# Altium project linda-express.PrjPCB
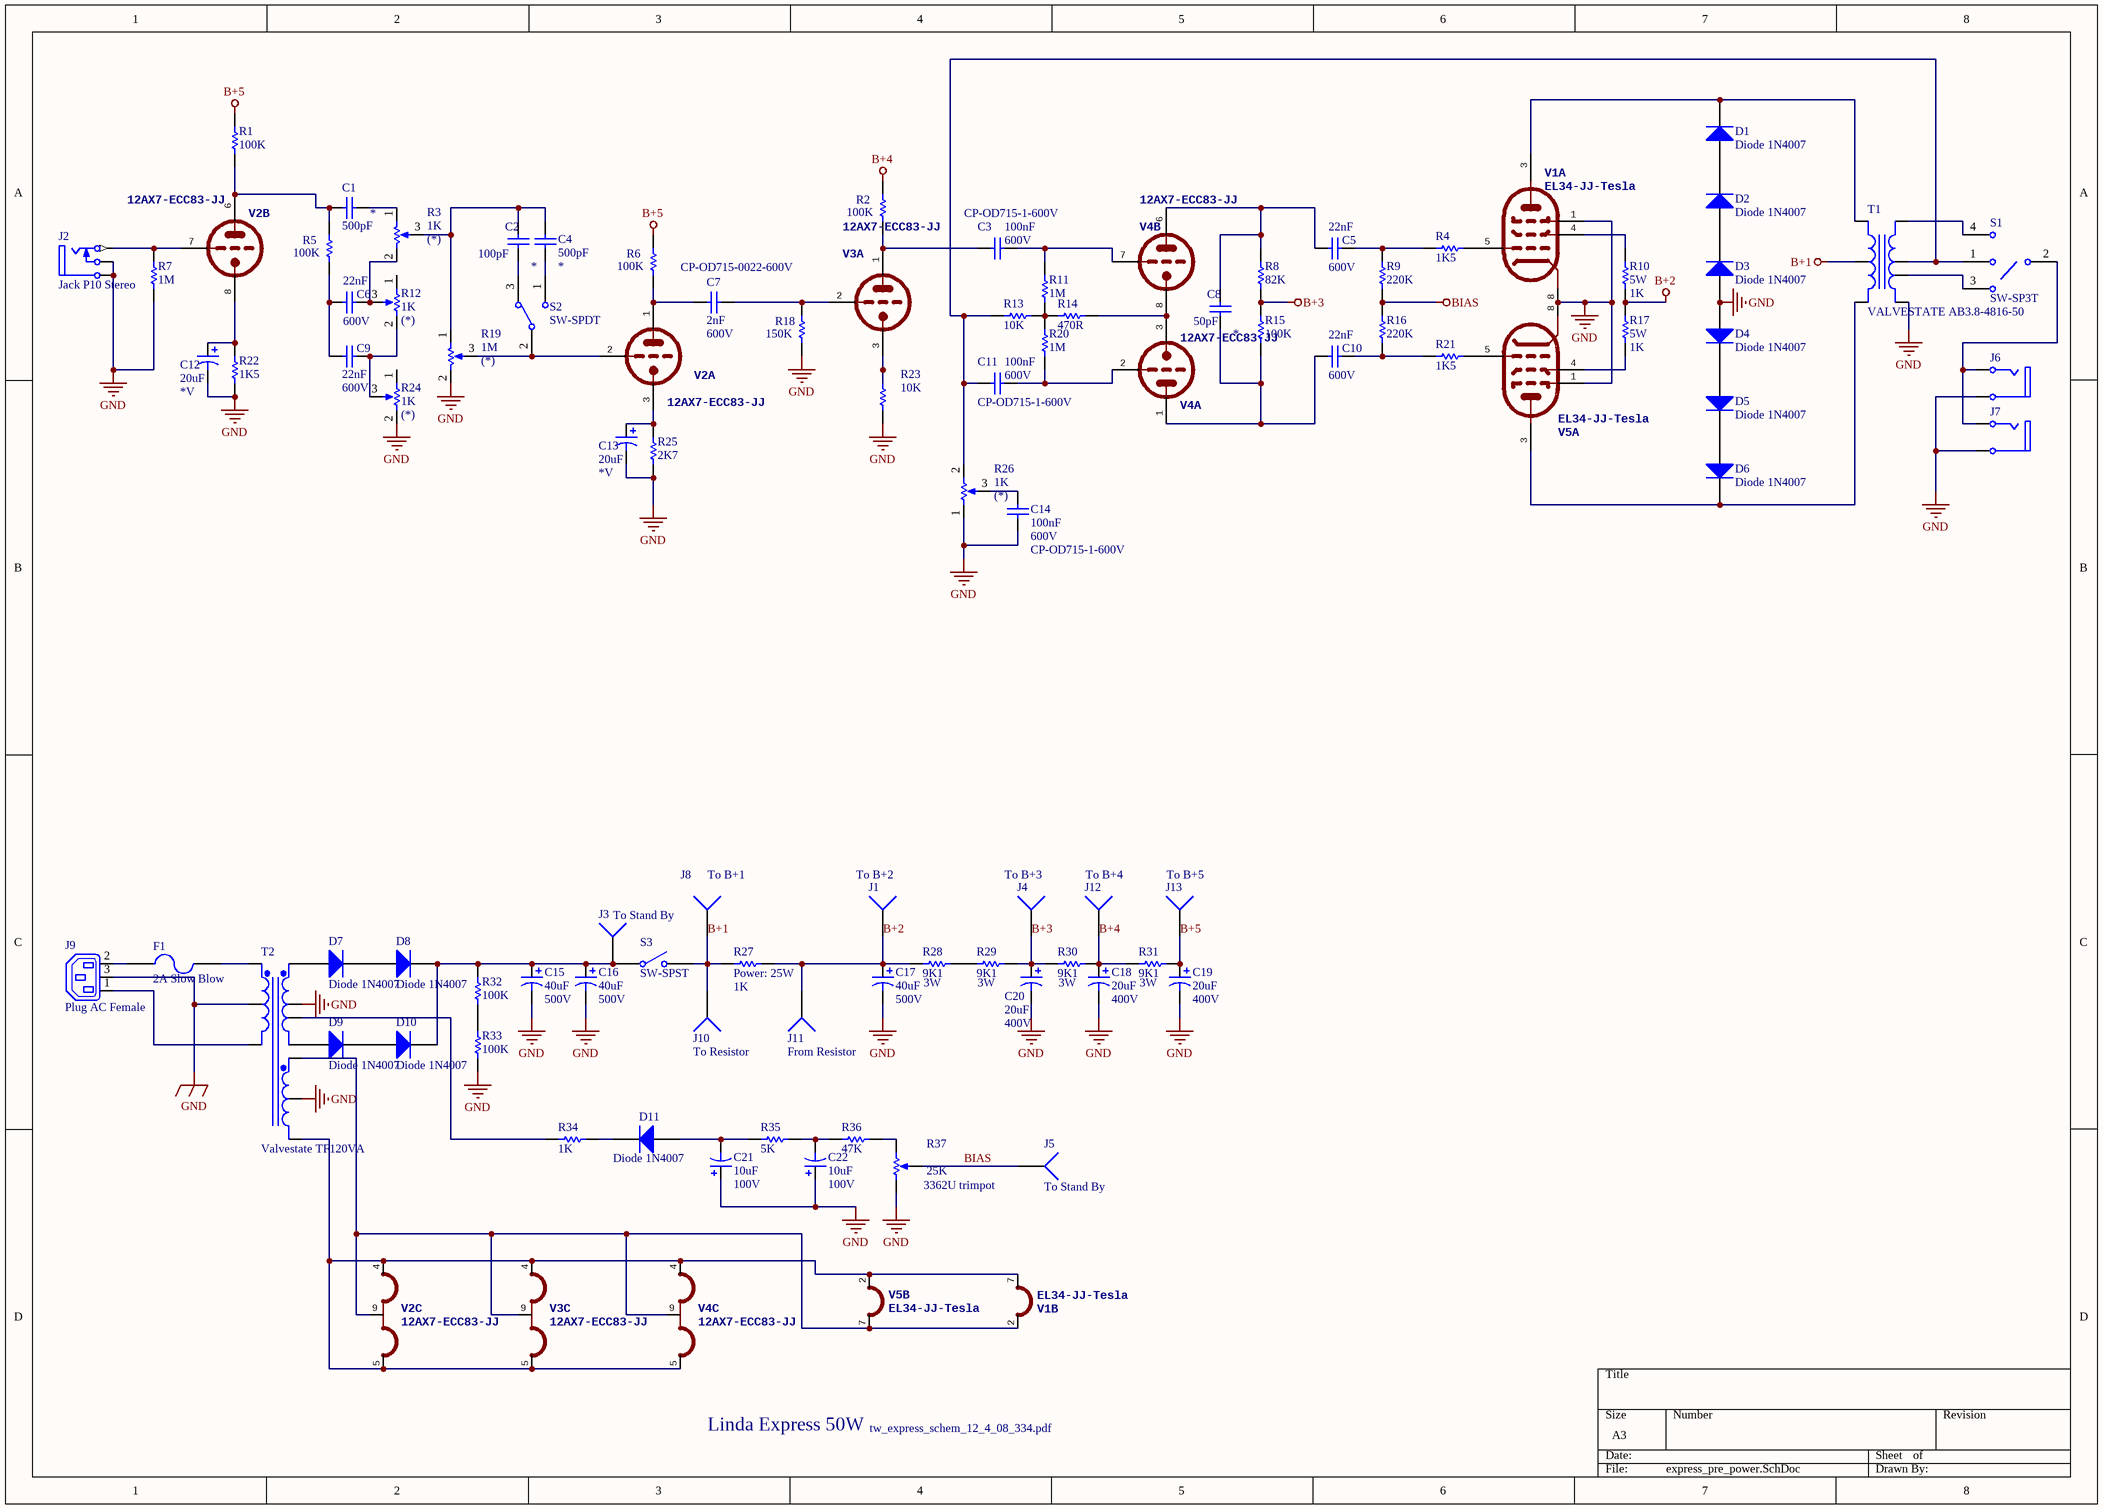
[diagram p0: express_pre_power.SchDoc]
1 sheet, 94 parts. Net scope: global (net labels, ports and power ports of the same name join across sheets).
Board file: linda-express-pcb-v0.1.PcbDoc

## Sheet express_pre_power.SchDoc: Linda Express 50W
size A3; Date: 25/05/2014; Author: Eduardo Marques; CompanyName: Linda HB Amplifiers; DrawnBy: Eduardo Marques; Engineer: Eduardo Marques; Organization: Linda HB Amplifiers; DocumentNumber: 1; Revision: 1; SheetNumber: 1; Based: tw_express_schem_12_4_08_334.pdf; CurrentTime: 08:04; CurrentDate: 25/05/2014; DocumentName: Linda TW Express 50W Complete; ProjectName: linda-express

### Parts
C1  value 500pF  [RAD-0.2]  (hidden comment: Ceramic Cap)
C2  value 100pF  [RAD-0.2]  (hidden comment: Ceramic Cap)
C3  value 100nF  Voltage: 600V  TUBEDEPOT_SN: CP-OD715-1-600V  [ORANGE-DROP-100nF-600V]  (hidden comment: Orange Drop Capacitor)
C4  value 500pF  [RAD-0.2]  (hidden comment: Ceramic Cap)
C5  value 22nF  Voltage: 600V  [ORANGE-DROP-22nF-600V]  (hidden comment: Orange Drop Capacitor)
C6  value 22nF  Voltage: 600V  [ORANGE-DROP-22nF-600V]  (hidden comment: Orange Drop Capacitor)
C7  value 2nF  Voltage: 600V  TubeDepotPN: CP-OD715-0022-600V  [ORANGE-DROP-2nF-600V]  (hidden comment: Orange Drop Capacitor)
C8  value 50pF  [RAD-0.2]  (hidden comment: Ceramic Cap)
C9  value 22nF  Voltage: 600V  [ORANGE-DROP-22nF-600V]  (hidden comment: Orange Drop Capacitor)
C10  value 22nF  Voltage: 600V  [ORANGE-DROP-22nF-600V]  (hidden comment: Orange Drop Capacitor)
C11  value 100nF  Voltage: 600V  TUBEDEPOT_SN: CP-OD715-1-600V  [ORANGE-DROP-100nF-600V]  (hidden comment: Orange Drop Capacitor)
C12  value 20uF  Voltage: *V  [AXIAL-POL-30mm]  (hidden comment: Cap Pol Axial)
C13  value 20uF  Voltage: *V  [AXIAL-POL-30mm]  (hidden comment: Cap Pol Axial)
C14  value 100nF  Voltage: 600V  TUBEDEPOT_SN: CP-OD715-1-600V  [ORANGE-DROP-100nF-600V]  (hidden comment: Orange Drop Capacitor)
C15  value 40uF  Voltage: 500V  [SPRAGUE-ATOM-40uF-500V]  (hidden comment: Sprague Atom Eletrolitic 40uF Axial 500V)
C16  value 40uF  Voltage: 500V  [SPRAGUE-ATOM-40uF-500V]  (hidden comment: Sprague Atom Eletrolitic 40uF Axial 500V)
C17  value 40uF  Voltage: 500V  [SPRAGUE-ATOM-40uF-500V]  (hidden comment: Sprague Atom Eletrolitic 40uF Axial 500V)
C18  value 20uF  Voltage: 400V  [RAD-POL-7.6-15]  (hidden comment: Cap Pol Rad)
C19  value 20uF  Voltage: 400V  [RAD-POL-7.6-15]  (hidden comment: Cap Pol Rad)
C20  value 20uF  Voltage: 400V  [RAD-POL-7.6-15]  (hidden comment: Cap Pol Rad)
C21  value 10uF  Voltage: 100V  [RAD-POL-16x20x7.5]  (hidden comment: Cap Pol Radial Vishay 22uF 100V)
C22  value 10uF  Voltage: 100V  [RAD-POL-16x20x7.5]  (hidden comment: Cap Pol Radial Vishay 22uF 100V)
D1  Diode 1N4007  [1N4007-10.46mm Diode]
D2  Diode 1N4007  [1N4007-10.46mm Diode]
D3  Diode 1N4007  [1N4007-10.46mm Diode]
D4  Diode 1N4007  [1N4007-10.46mm Diode]
D5  Diode 1N4007  [1N4007-10.46mm Diode]
D6  Diode 1N4007  [1N4007-10.46mm Diode]
D7  Diode 1N4007  [1N4007-10.46mm Diode]
D8  Diode 1N4007  [1N4007-10.46mm Diode]
D9  Diode 1N4007  [1N4007-10.46mm Diode]
D10  Diode 1N4007  [1N4007-10.46mm Diode]
D11  Diode 1N4007  [1N4007-10.46mm Diode]
F1  2A Slow Blow  [FUSE-PCB-5x20mm]  (mechanical)
J1  To B+2  [PIN1]  (mechanical)
J2  Jack P10 Stereo  [JACK-STEREO-3PAD]
J3  To Stand By  [PIN1]
J4  To B+3  [PIN1]  (mechanical)
J5  To Stand By  [PIN1]  (mechanical)
J6  Jack Mono  [JACK-STEREO-3PAD]  (value not drawn)  (mechanical)
J7  Jack Mono  [JACK-STEREO-3PAD]  (value not drawn)  (mechanical)
J8  To B+1  [PIN1]  (mechanical)
J9  Plug AC Female  [IEC7-2H3]  (mechanical)
J10  To Resistor  [PIN1]
J11  From Resistor  [PIN1]
J12  To B+4  [PIN1]  (mechanical)
J13  To B+5  [PIN1]  (mechanical)
R1  value 100K  [AXIAL-0.6]  (hidden comment: Metal Film Resistor 1/2W)
R2  value 100K  [AXIAL-0.6]  (hidden comment: Metal Film Resistor 1/2W)
R3  value 1K  TYPE: (*)  [pot_alpha]  (hidden comment: ALPHA Potentiometer)
R4  value 1K5  [AXIAL-0.6]  (hidden comment: Metal Film Resistor 1/2W)
R5  value 100K  [AXIAL-0.6]  (hidden comment: Metal Film Resistor 1/2W)
R6  value 100K  [AXIAL-0.6]  (hidden comment: Metal Film Resistor 1/2W)
R7  value 1M  [AXIAL-0.6]  (hidden comment: Metal Film Resistor 1/2W)  (mechanical)
R8  value 82K  [AXIAL-0.6]  (hidden comment: Metal Film Resistor 1/2W)
R9  value 220K  [AXIAL-0.6]  (hidden comment: Metal Film Resistor 1/2W)
R10  value 1K  Power: 5W  [Resistor Vishay 5W 1k Power Wirewound]  (hidden comment: Wire Wound Power Resistor)
R11  value 1M  [AXIAL-0.6]  (hidden comment: Metal Film Resistor 1/2W)
R12  value 1K  TYPE: (*)  [pot_alpha]  (hidden comment: ALPHA Potentiometer)
R13  value 10K  [AXIAL-0.6]  (hidden comment: Metal Film Resistor 1/2W)
R14  value 470R  [AXIAL-0.6]  (hidden comment: Metal Film Resistor 1/2W)
R15  value 100K  [AXIAL-0.6]  (hidden comment: Metal Film Resistor 1/2W)
R16  value 220K  [AXIAL-0.6]  (hidden comment: Metal Film Resistor 1/2W)
R17  value 1K  Power: 5W  [Resistor Vishay 5W 1k Power Wirewound]  (hidden comment: Wire Wound Power Resistor)
R18  value 150K  [AXIAL-0.6]  (hidden comment: Metal Film Resistor 1/2W)
R19  value 1M  TYPE: (*)  [pot_alpha]  (hidden comment: ALPHA Potentiometer)
R20  value 1M  [AXIAL-0.6]  (hidden comment: Metal Film Resistor 1/2W)
R21  value 1K5  [AXIAL-0.6]  (hidden comment: Metal Film Resistor 1/2W)
R22  value 1K5  [AXIAL-0.6]  (hidden comment: Metal Film Resistor 1/2W)
R23  value 10K  [AXIAL-0.6]  (hidden comment: Metal Film Resistor 1/2W)
R24  value 1K  TYPE: (*)  [pot_alpha]  (hidden comment: ALPHA Potentiometer)
R25  value 2K7  [AXIAL-0.6]  (hidden comment: Metal Film Resistor 1/2W)
R26  value 1K  TYPE: (*)  [pot_alpha]  (hidden comment: ALPHA Potentiometer)
R27  value 1K  Power: 25W  [Power Wirewound Resistor 10W - Vishay Dale]  (hidden comment: Wire Wound Power Resistor)  (mechanical)
R28  value 9K1  Power: 3W  [RESISTOR-MetalOxide-3W]  (hidden comment: Metal Film Resistor 1/2W)
R29  value 9K1  Power: 3W  [RESISTOR-MetalOxide-3W]  (hidden comment: Metal Film Resistor 1/2W)
R30  value 9K1  Power: 3W  [RESISTOR-MetalOxide-3W]  (hidden comment: Metal Film Resistor 1/2W)
R31  value 9K1  Power: 3W  [RESISTOR-MetalOxide-3W]  (hidden comment: Metal Film Resistor 1/2W)
R32  value 100K  [RESISTOR-MetalOxide-3W]  (hidden comment: Metal Film Resistor 1/2W)
R33  value 100K  [RESISTOR-MetalOxide-3W]  (hidden comment: Metal Film Resistor 1/2W)
R34  value 1K  [RESISTOR-MetalOxide-3W]  (hidden comment: Metal Film Resistor 1/2W)
R35  value 5K  [RESISTOR-MetalOxide-3W]  (hidden comment: Metal Film Resistor 1/2W)
R36  value 47K  [RESISTOR-MetalOxide-3W]  (hidden comment: Metal Film Resistor 1/2W)
R37  3362U trimpot  value 25K  [33262U trimpot]
S1  SW-SP3T  [TL36WW15050]  (mechanical)
S2  SW-SPDT  [SPDT]
S3  SW-SPST  [SPST-2]  (mechanical)
T1  Output Transformer  [VALVESTATE-AB3.8-4816-50]  (value not drawn)  (mechanical)
T2  Valvestate TF120VA  [TRF_10]  (mechanical)
V1  EL34-JJ-Tesla  [EL34-JJ]  (parts A,B of 2)
V2  12AX7-ECC83-JJ  [12AX7(ECC83)-JJ Tesla]  (parts A,B,C of 3)
V3  12AX7-ECC83-JJ  [12AX7(ECC83)-JJ Tesla]  (parts A,C of 3)
V4  12AX7-ECC83-JJ  [12AX7(ECC83)-JJ Tesla]  (parts A,B,C of 3)
V5  EL34-JJ-Tesla  [EL34-JJ]  (parts A,B of 2)

### Nets
B+1: J8.1 J10.1 R27.1 S3.2(NO) T1.2(B+)
B+2: C17.1 J1.1 J11.1 R10.1 R17.2 R27.2 R28.1
B+3: C20.1 J4.1 R8.1 R15.2 R29.2 R30.1
B+4: C18.1 J12.1 R2.2 R30.2 R31.1
B+5: C19.1 J13.1 R1.2 R6.2 R31.2
BIAS: J5.1 R9.1 R16.2 R37.3(TAP)
GND: C12.2 C13.2 C14.1 C15.2 C16.2 C17.2 C18.2 C19.2 C20.2 C21.1 C22.1 D3.1(A) D4.1(A) J2.2(TN) J2.5(S) J6.2(S) J7.2(S) J9.3(E) R7.1 R18.1 R19.2(BOT) R22.1 R23.1 R24.2(BOT) R25.1 R26.1(TOP) R33.1 R37.1(TOP) T1.7(Common) T2.2(Pri+_127V) T2.5(SEC_CT) T2.9(3.15V_CT) V1.1(PBG) V1.8(PK) V5.1(PBG) V5.8(PK)
NetC1_1: C1.1 R1.1 R5.2 V2.6(TA)
NetC1_2: C1.2 R3.1(TOP)
NetC2_1: C2.1 S2.3
NetC2_2: C2.2 C4.2 R3.3(TAP) R19.1(TOP)
NetC3_1: C3.1 R2.1 V3.1(TA)
NetC3_2: C3.2 R11.2 V4.7(TG)
NetC4_1: C4.1 S2.1
NetC5_1: C5.1 C8.2 R8.2 V4.6(TA)
NetC5_2: C5.2 R4.2 R9.2
NetC6_1: C6.1 C9.1 R5.1
NetC6_2: C6.2 R3.2(BOT) R12.3(TAP)
NetC7_1: C7.1 R6.1 V2.1(TA)
NetC7_2: C7.2 R18.2 V3.2(TG)
NetC8_1: C8.1 C10.1 R15.1 V4.1(TA)
NetC9_2: C9.2 R12.2(BOT) R24.3(TAP)
NetC10_2: C10.2 R16.1 R21.2
NetC11_1: C11.1 R13.2 R26.2(BOT) S1.1 T1.5(8_ohms)
NetC11_2: C11.2 R20.1 V4.2(TG)
NetC12_1: C12.1 R22.2 V2.8(TK)
NetC13_1: C13.1 R25.2 V2.3(TK)
NetC14_2: C14.2 R26.3(TAP)
NetC15_1: C15.1 C16.1 D8.2(K) D10.2(K) J3.1 R32.2 S3.1(COMMON)
NetC21_2: C21.2 D11.1(A) R35.2
NetC22_2: C22.2 R35.1 R36.2
NetD1_1: D1.1(A) D2.2(K)
NetD1_2: D1.2(K) T1.1(A1) V1.3(PA)
NetD2_1: D2.1(A) D3.2(K)
NetD4_2: D4.2(K) D5.1(A)
NetD5_2: D5.2(K) D6.1(A)
NetD6_2: D6.2(K) T1.3(A2) V5.3(PA)
NetD7_1: D7.1(A) T2.4(Sec_355V_+)
NetD7_2: D7.2(K) D8.1(A)
NetD9_1: D9.1(A) T2.7(Sec_355V_-)
NetD9_2: D9.2(K) D10.1(A)
NetD11_2: D11.2(K) R34.1
NetF1_1: F1.1 J9.2(N)
NetF1_2: F1.2 T2.1(Pri+220V)
NetJ2_1: J2.1(T) R7.2 V2.7(TG)
NetJ6_1: J6.1(T) J7.1(T) S1.2
NetJ9_1: J9.1(L) T2.3(Pri-)
NetR4_1: R4.1 V1.5(PG)
NetR10_2: R10.2 V1.4(PSG)
NetR11_1: R11.1 R13.1 R14.2 R20.2
NetR14_1: R14.1 V4.3(TK) V4.8(TK)
NetR17_1: R17.1 V5.4(PSG)
NetR19_3: R19.3(TAP) S2.2 V2.2(TG)
NetR21_1: R21.1 V5.5(PG)
NetR23_2: R23.2 V3.3(TK)
NetR28_2: R28.2 R29.1
NetR32_1: R32.1 R33.2
NetR34_2: R34.2 T2.6(Sec_55V_+)
NetR36_1: R36.1 R37.2(BOT)
NetS1_3: S1.3 T1.6(4_ohms)
NetS1_4: S1.4 T1.4(16_omhs)
NetT2_8: T2.8(3.15V+) V1.2(H1) V2.9(H2) V3.9(H2) V4.9(H2) V5.7(H2)
NetT2_10: T2.10(3.15V_-) V1.7(H2) V2.4(H1) V2.5(H3) V3.4(H1) V3.5(H3) V4.4(H1) V4.5(H3) V5.2(H1)

Not connected (* = marked no-connect by the designer): R12 1(TOP); R24 1(TOP)

### Library data of the parts
C1 C2 C4 C8 = Cap-Ceramic-Small: Capacitor; Published: 8-Jun-2000; LatestRevisionDate: 17-Jul-2002; LatestRevisionNote: Re-released for DXP Platform.; PackageReference: RAD-0.3; Publisher: Altium Limited; PackageDescription: Radial Cap, Thru-Hole; 2 Leads; 0.3 in Pin Spacing; Voltage: *
C3 C11 C14 = Cap-Orange-DROP-100nF-600V: Capacitor; ManufacturerPartNumber: 715P10496L; Published: 8-Jun-2000; LatestRevisionDate: 17-Jul-2002; LatestRevisionNote: Re-released for DXP Platform.; PackageReference: RAD-0.3; Publisher: Altium Limited; PackageDescription: Radial Cap, Thru-Hole; 2 Leads; 0.3 in Pin Spacing
C5 C6 C9 C10 = Cap-Orange-DROP-22nF-600V: Capacitor; ManufacturerPartNumber: 715P22356KD3; Published: 23-April-2014; LatestRevisionDate: 23-April-2014; LatestRevisionNote: Creating the document; PackageReference: Orange Drop; Publisher: Linda HB Amplifiers; PackageDescription: Radial Cap, Thru-Hole; 2 Leads; 9.75mm Pin Spacing
C7 = Cap-Orange-DROP-2nF-600V: Capacitor; ManufacturerPartNumber: 715P22296J; Published: 1-June-2014; LatestRevisionDate: 1-June-2014; LatestRevisionNote: Creating the document; PackageReference: Orange Drop; Publisher: Linda HB Amplifiers; PackageDescription: Radial Cap, Thru-Hole; 2 Leads; 9.75mm Pin Spacing
C12 C13 = Cap Pol Axial: Polarized Capacitor Axial; Published: 8-Jun-2000; LatestRevisionDate: 12-Feb-2014; LatestRevisionNote: Re-released for DXP Platform.; PackageReference: POLAR0.8; Publisher: Whitesheep Amps; PackageDescription: Polarized Capacitor; 2 Leads
C18-C20 = Cap Pol Rad: Polarized Capacitor (Axial); Published: 8-Jun-2000; LatestRevisionDate: 17-Jul-2002; LatestRevisionNote: Re-released for DXP Platform.; PackageReference: POLAR0.8; Publisher: Altium Limited; PackageDescription: Polarized Capacitor; 2 Leads
C21 C22 = Cap Pol Radial Vishay 22uF 100V: Vishay 22uF 100V Polarized Capacitor (Radial); 2 Leads; Part Number: 142 RHS; Published: 8-Jun-2000; LatestRevisionDate: 17-Jul-2002; LatestRevisionNote: Re-released for DXP Platform.; PackageReference: POLAR0.8; Publisher: Altium Limited; PackageDescription: Polarized Capacitor; 2 Leads
D1-D11 = Diode 1N4007: 1 Amp General Purpose Rectifier; Published: 8-Jun-2000; LatestRevisionDate: 17-Jul-2002; LatestRevisionNote: Re-released for DXP Platform.; DatasheetVersion: 1998; PackageVersion: Aug-1999; PackageReference: DO-41; Publisher: Altium Limited; PackageDescription: Diode, Axial; Body 5.2 x 2.7 mm (LxDia. max), Lead Dia. 0.86 mm (max); Code_JEDEC: DO-204-AL; ComponentLink1Description: Manufacturer Link; ComponentLink1URL: http://www.fairchildsemi.com/; ComponentLink2Description: Datasheet; ComponentLink2URL: http://www.fairchildsemi.com/ds/1N%2F1N4001.pdf
F1 = Fuse 2: Fuse; Published: 8-Jun-2000; LatestRevisionDate: 17-Jul-2002; LatestRevisionNote: Re-released for DXP Platform.; PackageReference: PIN-W2/E2.8; Publisher: Altium Limited; PackageDescription: Thru-Hole; 2 Leads
J1 J3-J5 J8 J10-J13 = Socket: LatestRevisionDate: 17-Jul-2002; LatestRevisionNote: Re-released for DXP Platform.; Publisher: Altium Limited
J2 = Jack P10 Stereo: Jack Socket, 1/4" [6.5mm], Thru-Hole, Vertical, 2-Conductor with Tip closed; PackageDocument: 2003; PCB_Layout: Complies with manufacturer's recommendation.; DrillAndSlotSize: Corresponds to nominal value.; LatestRevisionDate: 15-Jul-2004; LatestRevisionNote: Component Replaced & renamed from "Phonejack".; DatasheetDocument: 2003; PackageReference: S1VS_SNB; Publisher: Altium Limited; ComponentLink1Description: Manufacturer Link; ComponentLink1URL: http://www.cliffuk.co.uk/
J6 J7 = Jack Mono P10: Jack Socket, Thru-Hole, Vertical, 2-Conductor Open Circuit; PackageDocument: 2003; PCB_Layout: Complies with manufacturer's recommendation.; DrillAndSlotSize: Corresponds to nominal value.; LatestRevisionDate: 15-Jul-2004; LatestRevisionNote: Component Replaced.; DatasheetDocument: 2003; PackageReference: S1VS_SNS; Publisher: Altium Limited; ComponentLink1Description: Manufacturer Link; ComponentLink1URL: http://www.cliffuk.co.uk/
J9 = Plug AC Female: IEC Mains Power Outlet, EN60 320-2-2 F Class I, PC Flange Rear Mount, Chassis Socket; PackageDocument: ver.80, 15-Sep-2003; MaximumRating: 10A, 250V a.c. (UL & CSA 15A, 250V a.c.); MountingFixtures: Not drawn on schematic symbol.; PCB_Layout: Complies with manufacturer's recommendation.; DrillSize: Corresponds to nominal value.; Published: 15-Jul-2004; LatestRevisionDate: 15-Jul-2004; LatestRevisionNote: Component Replaced & renamed from "Phonejack".; DatasheetDocument: ver.80, 15-Sep-2003; PackageReference: PX0675/PC; Publisher: Altium Limited; Terminations: P.C. Spills; ComponentLink1Description: Manufacturer Link; ComponentLink1URL: http://www.bulgin.co.uk/
R1 R2 R4-R9 R11 R13-R16 R18 R20-R23 R25 = Res Metal Film 1/2W: Semiconductor Resistor; Published: 8-Jun-2000; LatestRevisionDate: 17-Jul-2002; LatestRevisionNote: 12-Fev-2014; PackageReference: AXIAL-0.5; Publisher: Whitesheep Amps; PackageDescription: Axial Device, Thru-Hole; 2 Leads; 0.5 in Pin Spacing; Power: 1/2W
R3 R12 R19 R24 R26 = alpha-pot: Potentiometer; Sim Note: Enter the Resistance value and the set point into parameter fields.; Set Position: 0.5; Published: 8-Jun-2000; LatestRevisionDate: 17-Jul-2002; LatestRevisionNote: Re-released for DXP Platform.; PackageReference: VR5; Publisher: Altium Limited; PackageDescription: Variable Resistor, Thru-Hole; 3 Leads
R10 R17 = Res Wire Wound Power Resistor 5W: Semiconductor Resistor; Published: 8-Jun-2014; LatestRevisionDate: 17-Jul-2002; LatestRevisionNote: 12-Fev-2014; PackageReference: AXIAL-1.0; Publisher: Whitesheep Amps; PackageDescription: Axial Device, Thru-Hole; 2 Leads; 0.5 in Pin Spacing
R27 = Res Vishay Dale Wire Wound Power Resistor 10R 10W: Semiconductor Resistor; Published: 8-Jun-2014; LatestRevisionDate: 17-Jul-2002; LatestRevisionNote: 12-Fev-2014; PackageReference: AXIAL-1.0; Publisher: Whitesheep Amps; PackageDescription: Axial Device, Thru-Hole; 2 Leads; 0.5 in Pin Spacing
R28-R36 = Res Metal Oxide 3W: Semiconductor Resistor; Published: 8-Jun-2000; LatestRevisionDate: 17-Jul-2002; LatestRevisionNote: 12-Fev-2014; PackageReference: AXIAL-0.5; Publisher: Linda HandBuilt Amplifiers; PackageDescription: Axial Device, Thru-Hole; 2 Leads; 0.5 in Pin Spacing
  R32-R36: Power: 1/2W
R37 = 3362U trimpot: 3362U Timpot; Sim Note: Enter the Resistance value and the set point into parameter fields.; Set Position: 0.5; Published: 01-Apr-2014; LatestRevisionDate: 01-Apr-2014; LatestRevisionNote: Re-released for DXP Platform.; PackageReference: 3362; Publisher: Linda Hand Build Amplification; PackageDescription: Variable Trimpot Resistor, Thru-Hole; 3 Leads
S1 = SW-SP3T: SPDT Subminiature Toggle Switch, Right Angle Mounting, Vertical Actuation; Published: 24-Mar-1999; LatestRevisionDate: 17-Dec-2003; LatestRevisionNote: Schematic revised, PCB Footprint replaced.; DatasheetVersion: 05-Dec-2000; PackageReference: TL36WW15050; Publisher: Altium Limited; PackageDescription: Switch; 4 Leads; ComponentLink1Description: Manufacturer Link; ComponentLink1URL: http://www.apem.com
S2 = SW-SPDT: SPDT Subminiature Toggle Switch, Right Angle Mounting, Vertical Actuation; Published: 24-Mar-1999; LatestRevisionDate: 17-Dec-2003; LatestRevisionNote: Schematic revised, PCB Footprint replaced.; DatasheetVersion: 05-Dec-2000; PackageReference: TL36WW15050; Publisher: Altium Limited; PackageDescription: Switch; 4 Leads; ComponentLink1Description: Manufacturer Link; ComponentLink1URL: http://www.apem.com
S3 = SW-SPST: Single-Pole, Single-Throw Switch; Published: 24-Mar-1999; LatestRevisionDate: 17-Jul-2002; LatestRevisionNote: Re-released for DXP Platform.; PackageReference: SPST-2; Publisher: Altium Limited; PackageDescription: Switch; 2 Leads
T1 = VALVESTATE AB3.8-4816-50: Published: 29-Mar-2014; LatestRevisionDate: 29-Mar-2014; LatestRevisionNote: Construção do Trafo Hammond para Bassman 5F6A; PackageReference: TRF_10; Publisher: LINDA Hand Built Amplifiers; PackageDescription: Transformer; 10Leads; PartNumber: VALVESTATE AB3.8-4816-50
T2 = Valvestate TF120VA: VALVESTATE TF 120VA; Published: 29-Mar-2014; LatestRevisionDate: 29-Mar-2014; LatestRevisionNote: Construção do Trafo Hammond para Bassman 5F6A; PackageReference: TRF_10; Publisher: LINDA Hand Built Amplifiers; PackageDescription: Transformer; 10Leads
C15-C17 = Sprague Atom Eletrolitic 40uF Axial 500V: Published: 8-Jun-2000; LatestRevisionDate: 12-Feb-2014; LatestRevisionNote: Re-released for DXP Platform.; PackageReference: POLAR0.8; Publisher: Whitesheep Amps; PackageDescription: Polarized Capacitor; 2 Leads